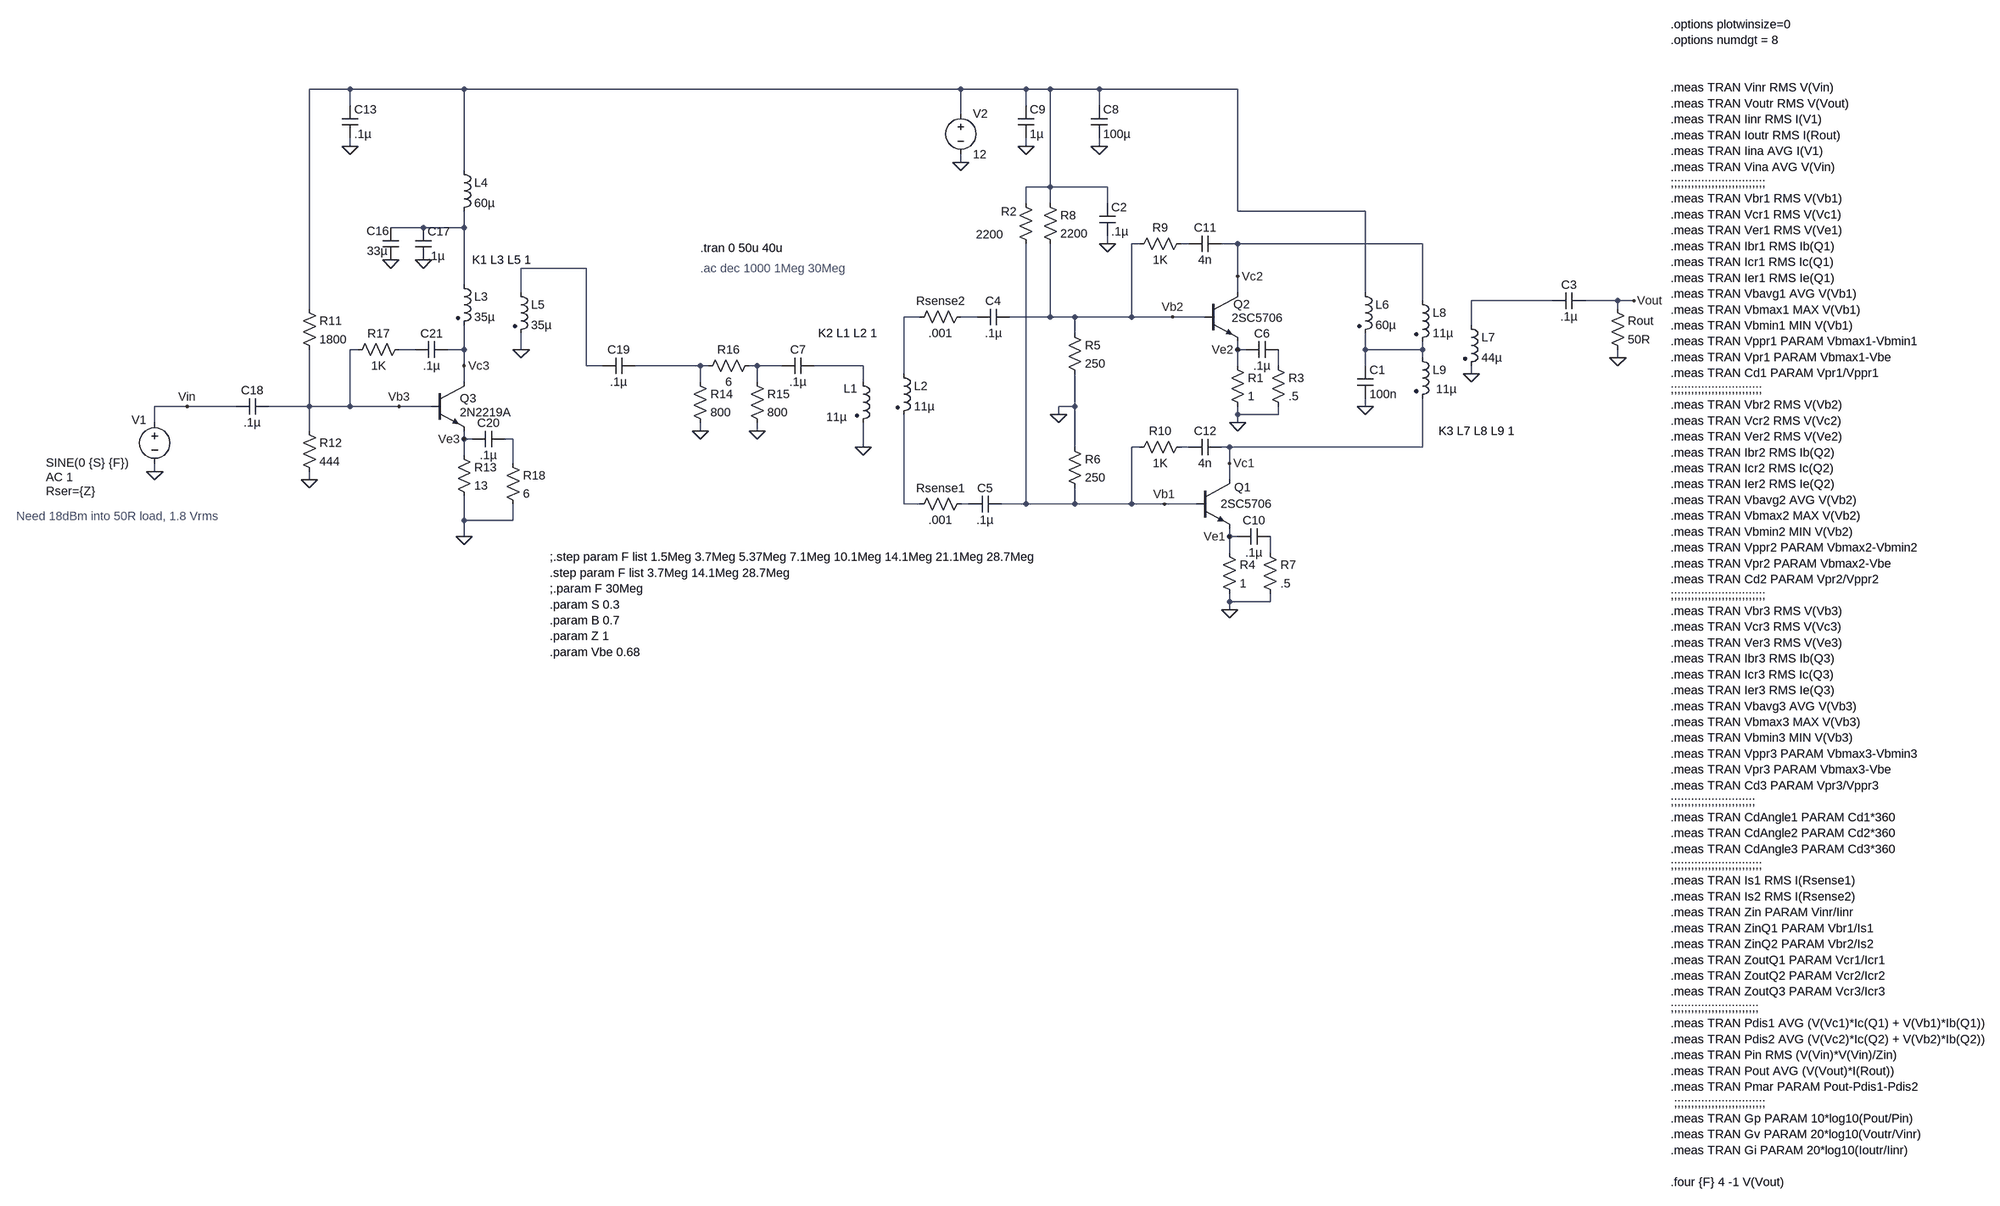
[diagram p0: schematic 2N2219+SC5706 Push-Pull.asc]
2N2219+SC5706 Push-Pull.asc, the LTspice schematic file:
Version 4
SHEET 1 3748 1496
WIRE -1312 -624 -1392 -624
WIRE -1088 -624 -1312 -624
WIRE -112 -624 -1088 -624
WIRE 16 -624 -112 -624
WIRE 64 -624 16 -624
WIRE 160 -624 64 -624
WIRE 432 -624 160 -624
WIRE -1312 -592 -1312 -624
WIRE 16 -592 16 -624
WIRE 160 -592 160 -624
WIRE -112 -576 -112 -624
WIRE -1312 -512 -1312 -528
WIRE 16 -512 16 -528
WIRE 160 -512 160 -528
WIRE -112 -480 -112 -496
WIRE -1088 -464 -1088 -624
WIRE 64 -432 64 -624
WIRE 64 -432 16 -432
WIRE 176 -432 64 -432
WIRE 16 -400 16 -432
WIRE 64 -400 64 -432
WIRE 176 -400 176 -432
WIRE 432 -384 432 -624
WIRE 688 -384 432 -384
WIRE -1168 -352 -1232 -352
WIRE -1088 -352 -1088 -384
WIRE -1088 -352 -1168 -352
WIRE 176 -320 176 -336
WIRE 240 -320 224 -320
WIRE 336 -320 320 -320
WIRE 432 -320 400 -320
WIRE 800 -320 432 -320
WIRE -848 -272 -976 -272
WIRE 432 -256 432 -320
WIRE -1088 -240 -1088 -352
WIRE -976 -224 -976 -272
WIRE 432 -224 432 -256
WIRE 688 -224 688 -384
WIRE 800 -208 800 -320
WIRE 1056 -208 896 -208
WIRE 1184 -208 1120 -208
WIRE 1216 -208 1184 -208
WIRE -1392 -192 -1392 -624
WIRE 1184 -192 1184 -208
WIRE -192 -176 -224 -176
WIRE -80 -176 -112 -176
WIRE 64 -176 64 -320
WIRE 64 -176 -16 -176
WIRE 112 -176 64 -176
WIRE 224 -176 224 -320
WIRE 224 -176 112 -176
WIRE 304 -176 224 -176
WIRE 368 -176 304 -176
WIRE 896 -160 896 -208
WIRE 112 -144 112 -176
WIRE -1296 -112 -1312 -112
WIRE -1184 -112 -1216 -112
WIRE -1088 -112 -1088 -160
WIRE -1088 -112 -1120 -112
WIRE -976 -112 -976 -144
WIRE 432 -112 432 -128
WIRE 448 -112 432 -112
WIRE 688 -112 688 -144
WIRE 800 -112 800 -128
WIRE 800 -112 688 -112
WIRE 800 -96 800 -112
WIRE 1184 -96 1184 -112
WIRE -1088 -80 -1088 -112
WIRE -848 -80 -848 -272
WIRE -816 -80 -848 -80
WIRE -624 -80 -752 -80
WIRE -608 -80 -624 -80
WIRE -512 -80 -528 -80
WIRE -464 -80 -512 -80
WIRE -304 -80 -400 -80
WIRE 432 -80 432 -112
WIRE 512 -80 512 -112
WIRE 688 -80 688 -112
WIRE -224 -64 -224 -176
WIRE 896 -64 896 -80
WIRE -1088 -48 -1088 -80
WIRE -624 -48 -624 -80
WIRE -512 -48 -512 -80
WIRE -304 -48 -304 -80
WIRE -1632 0 -1696 0
WIRE -1536 0 -1632 0
WIRE -1392 0 -1392 -112
WIRE -1392 0 -1472 0
WIRE -1312 0 -1312 -112
WIRE -1312 0 -1392 0
WIRE -1216 0 -1312 0
WIRE -1152 0 -1216 0
WIRE 112 0 112 -64
WIRE 112 0 80 0
WIRE 688 0 688 -16
WIRE 80 16 80 0
WIRE 432 16 432 0
WIRE 512 16 512 0
WIRE 512 16 432 16
WIRE -1696 32 -1696 0
WIRE 432 32 432 16
WIRE -1392 48 -1392 0
WIRE -624 48 -624 32
WIRE -512 48 -512 32
WIRE -1088 64 -1088 48
WIRE -1072 64 -1088 64
WIRE -992 64 -1008 64
WIRE -304 80 -304 32
WIRE 112 80 112 0
WIRE 240 80 224 80
WIRE 336 80 320 80
WIRE 416 80 400 80
WIRE 800 80 800 -16
WIRE 800 80 416 80
WIRE -1088 96 -1088 64
WIRE -992 112 -992 64
WIRE 416 112 416 80
WIRE -1696 128 -1696 112
WIRE -1392 144 -1392 128
WIRE 416 144 416 112
WIRE -224 192 -224 16
WIRE -192 192 -224 192
WIRE -96 192 -112 192
WIRE 16 192 16 -320
WIRE 16 192 -32 192
WIRE 112 192 112 160
WIRE 112 192 16 192
WIRE 224 192 224 80
WIRE 224 192 112 192
WIRE 288 192 224 192
WIRE 352 192 288 192
WIRE -1088 224 -1088 176
WIRE -992 224 -992 192
WIRE -992 224 -1088 224
WIRE -1088 256 -1088 224
WIRE 416 256 416 240
WIRE 432 256 416 256
WIRE 416 288 416 256
WIRE 496 288 496 256
WIRE 416 384 416 368
WIRE 496 384 496 368
WIRE 496 384 416 384
WIRE 416 400 416 384
FLAG -112 -480 0
FLAG -1696 128 0
FLAG 416 400 0
FLAG 1216 -208 Vout
FLAG 1184 -96 0
FLAG 288 192 Vb1
FLAG 416 256 Ve1
FLAG -1632 0 Vin
FLAG 416 112 Vc1
FLAG 432 32 0
FLAG 304 -176 Vb2
FLAG 432 -112 Ve2
FLAG 432 -256 Vc2
FLAG -304 80 0
FLAG 80 16 0
FLAG 688 0 0
FLAG 176 -320 0
FLAG 16 -512 0
FLAG 896 -64 0
FLAG 160 -512 0
FLAG -1312 -512 0
FLAG -1392 144 0
FLAG -1088 256 0
FLAG -1232 -288 0
FLAG -1168 -288 0
FLAG -1216 0 Vb3
FLAG -1088 64 Ve3
FLAG -1088 -80 Vc3
FLAG -624 48 0
FLAG -512 48 0
FLAG -976 -112 0
SYMBOL npn 352 144 R0
WINDOW 0 73 15 Left 2
WINDOW 3 47 48 Left 2
SYMATTR InstName Q1
SYMATTR Value 2SC5706
SYMBOL voltage -1696 16 R0
WINDOW 0 -45 11 Left 2
WINDOW 3 -214 95 Left 2
WINDOW 123 -214 123 Left 2
WINDOW 39 -214 151 Left 2
SYMATTR InstName V1
SYMATTR Value SINE(0 {S} {F})
SYMATTR Value2 AC 1
SYMATTR SpiceLine Rser={Z}
SYMBOL voltage -112 -592 R0
WINDOW 123 0 0 Left 0
WINDOW 39 0 0 Left 0
SYMATTR InstName V2
SYMATTR Value 12
SYMBOL res 400 272 R0
SYMATTR InstName R4
SYMATTR Value 1
SYMBOL cap 1120 -224 R90
WINDOW 0 0 32 VBottom 2
WINDOW 3 32 32 VTop 2
SYMATTR InstName C3
SYMATTR Value .1µ
SYMBOL res 1168 -208 R0
SYMATTR InstName Rout
SYMATTR Value 50R
SYMBOL cap -400 -96 R90
WINDOW 0 0 32 VBottom 2
WINDOW 3 32 32 VTop 2
SYMATTR InstName C7
SYMATTR Value .1µ
SYMBOL npn 368 -224 R0
WINDOW 0 56 23 Left 2
WINDOW 3 52 50 Left 2
SYMATTR InstName Q2
SYMATTR Value 2SC5706
SYMBOL res 416 -96 R0
SYMATTR InstName R1
SYMATTR Value 1
SYMBOL ind2 -320 -64 R0
WINDOW 0 -22 29 Left 2
WINDOW 3 -56 85 Left 2
SYMATTR InstName L1
SYMATTR Value 11µ
SYMATTR Type ind
SYMBOL ind2 -240 -80 R0
SYMATTR InstName L2
SYMATTR Value 11µ
SYMATTR Type ind
SYMBOL res 48 -416 R0
SYMATTR InstName R8
SYMATTR Value 2200
SYMBOL res 96 -160 R0
SYMATTR InstName R5
SYMATTR Value 250
SYMBOL res 96 64 R0
SYMATTR InstName R6
SYMATTR Value 250
SYMBOL ind2 784 -224 R0
SYMATTR InstName L8
SYMATTR Value 11µ
SYMATTR Type ind
SYMBOL ind2 784 -112 R0
WINDOW 3 43 78 Left 2
SYMATTR Value 11µ
SYMATTR InstName L9
SYMATTR Type ind
SYMBOL ind2 880 -176 R0
SYMATTR InstName L7
SYMATTR Value 44µ
SYMATTR Type ind
SYMBOL ind2 672 -240 R0
SYMATTR InstName L6
SYMATTR Value 60µ
SYMATTR Type ind
SYMBOL cap 672 -80 R0
SYMATTR InstName C1
SYMATTR Value 100n
SYMBOL cap 160 -400 R0
SYMATTR InstName C2
SYMATTR Value .1µ
SYMBOL cap 0 -592 R0
SYMATTR InstName C9
SYMATTR Value 1µ
SYMBOL res 0 -416 R0
WINDOW 0 -33 33 Left 2
WINDOW 3 -82 78 Left 2
SYMATTR InstName R2
SYMATTR Value 2200
SYMBOL cap 144 -592 R0
SYMATTR InstName C8
SYMATTR Value 100µ
SYMBOL res -96 -192 R90
WINDOW 0 0 56 VBottom 2
WINDOW 3 32 56 VTop 2
SYMATTR InstName Rsense2
SYMATTR Value .001
SYMBOL res -96 176 R90
WINDOW 0 0 56 VBottom 2
WINDOW 3 32 56 VTop 2
SYMATTR InstName Rsense1
SYMATTR Value .001
SYMBOL cap -16 -192 R90
WINDOW 0 0 32 VBottom 2
WINDOW 3 32 32 VTop 2
SYMATTR InstName C4
SYMATTR Value .1µ
SYMBOL cap -32 176 R90
WINDOW 0 0 32 VBottom 2
WINDOW 3 32 32 VTop 2
SYMATTR InstName C5
SYMATTR Value .1µ
SYMBOL cap 512 -128 R90
WINDOW 0 0 32 VBottom 2
WINDOW 3 32 32 VTop 2
SYMATTR InstName C6
SYMATTR Value .1µ
SYMBOL cap 496 240 R90
WINDOW 0 0 32 VBottom 2
WINDOW 3 32 32 VTop 2
SYMATTR InstName C10
SYMATTR Value .1µ
SYMBOL res 496 -96 R0
SYMATTR InstName R3
SYMATTR Value .5
SYMBOL res 480 272 R0
SYMATTR InstName R7
SYMATTR Value .5
SYMBOL cap 400 -336 R90
WINDOW 0 0 32 VBottom 2
WINDOW 3 32 32 VTop 2
SYMATTR InstName C11
SYMATTR Value 4n
SYMBOL res 336 -336 R90
WINDOW 0 0 56 VBottom 2
WINDOW 3 32 56 VTop 2
SYMATTR InstName R9
SYMATTR Value 1K
SYMBOL cap 400 64 R90
WINDOW 0 0 32 VBottom 2
WINDOW 3 32 32 VTop 2
SYMATTR InstName C12
SYMATTR Value 4n
SYMBOL res 336 64 R90
WINDOW 0 0 56 VBottom 2
WINDOW 3 32 56 VTop 2
SYMATTR InstName R10
SYMATTR Value 1K
SYMBOL res -1408 -208 R0
SYMATTR InstName R11
SYMATTR Value 1800
SYMBOL res -1408 32 R0
SYMATTR InstName R12
SYMATTR Value 444
SYMBOL res -1104 80 R0
SYMATTR InstName R13
SYMATTR Value 13
SYMBOL cap -1328 -592 R0
SYMATTR InstName C13
SYMATTR Value .1µ
SYMBOL ind2 -1104 -256 R0
SYMATTR InstName L3
SYMATTR Value 35µ
SYMATTR Type ind
SYMBOL ind -1104 -480 R0
SYMATTR InstName L4
SYMATTR Value 60µ
SYMBOL cap -1248 -352 R0
WINDOW 0 -32 7 Left 2
WINDOW 3 -31 46 Left 2
SYMATTR InstName C16
SYMATTR Value 33µ
SYMBOL cap -1184 -352 R0
SYMATTR InstName C17
SYMATTR Value .1µ
SYMBOL cap -1472 -16 R90
WINDOW 0 0 32 VBottom 2
WINDOW 3 32 32 VTop 2
SYMATTR InstName C18
SYMATTR Value .1µ
SYMBOL res -640 -64 R0
SYMATTR InstName R14
SYMATTR Value 800
SYMBOL res -528 -64 R0
SYMATTR InstName R15
SYMATTR Value 800
SYMBOL res -512 -96 R90
WINDOW 0 0 56 VBottom 2
WINDOW 3 32 56 VTop 2
SYMATTR InstName R16
SYMATTR Value 6
SYMBOL ind2 -992 -240 R0
SYMATTR InstName L5
SYMATTR Value 35µ
SYMATTR Type ind
SYMBOL cap -752 -96 R90
WINDOW 0 0 32 VBottom 2
WINDOW 3 32 32 VTop 2
SYMATTR InstName C19
SYMATTR Value .1µ
SYMBOL npn -1152 -48 R0
WINDOW 3 56 60 Left 2
SYMATTR InstName Q3
SYMATTR Value 2N2219A
SYMBOL cap -1008 48 R90
WINDOW 0 0 32 VBottom 2
WINDOW 3 32 32 VTop 2
SYMATTR InstName C20
SYMATTR Value .1µ
SYMBOL cap -1120 -128 R90
WINDOW 0 0 32 VBottom 2
WINDOW 3 32 32 VTop 2
SYMATTR InstName C21
SYMATTR Value .1µ
SYMBOL res -1200 -128 R90
WINDOW 0 0 56 VBottom 2
WINDOW 3 32 56 VTop 2
SYMATTR InstName R17
SYMATTR Value 1K
SYMBOL res -1008 96 R0
SYMATTR InstName R18
SYMATTR Value 6
TEXT -624 -312 Left 2 !.tran 0 50u 40u
TEXT 1288 -752 Left 2 !.options plotwinsize=0\n.options numdgt = 8\n \n \n.meas TRAN Vinr RMS V(Vin)\n.meas TRAN Voutr RMS V(Vout)\n.meas TRAN Iinr RMS I(V1)\n.meas TRAN Ioutr RMS I(Rout)\n.meas TRAN Iina AVG I(V1)\n.meas TRAN Vina AVG V(Vin)\n;;;;;;;;;;;;;;;;;;;;;;;;;;;;\n.meas TRAN Vbr1 RMS V(Vb1)\n.meas TRAN Vcr1 RMS V(Vc1)\n.meas TRAN Ver1 RMS V(Ve1)\n.meas TRAN Ibr1 RMS Ib(Q1)\n.meas TRAN Icr1 RMS Ic(Q1)\n.meas TRAN Ier1 RMS Ie(Q1)\n.meas TRAN Vbavg1 AVG V(Vb1)\n.meas TRAN Vbmax1 MAX V(Vb1)\n.meas TRAN Vbmin1 MIN V(Vb1)\n.meas TRAN Vppr1 PARAM Vbmax1-Vbmin1\n.meas TRAN Vpr1 PARAM Vbmax1-Vbe\n.meas TRAN Cd1 PARAM Vpr1/Vppr1\n;;;;;;;;;;;;;;;;;;;;;;;;;;;\n.meas TRAN Vbr2 RMS V(Vb2)\n.meas TRAN Vcr2 RMS V(Vc2)\n.meas TRAN Ver2 RMS V(Ve2)\n.meas TRAN Ibr2 RMS Ib(Q2)\n.meas TRAN Icr2 RMS Ic(Q2)\n.meas TRAN Ier2 RMS Ie(Q2)\n.meas TRAN Vbavg2 AVG V(Vb2)\n.meas TRAN Vbmax2 MAX V(Vb2)\n.meas TRAN Vbmin2 MIN V(Vb2)\n.meas TRAN Vppr2 PARAM Vbmax2-Vbmin2\n.meas TRAN Vpr2 PARAM Vbmax2-Vbe\n.meas TRAN Cd2 PARAM Vpr2/Vppr2\n;;;;;;;;;;;;;;;;;;;;;;;;;;;;\n.meas TRAN Vbr3 RMS V(Vb3)\n.meas TRAN Vcr3 RMS V(Vc3)\n.meas TRAN Ver3 RMS V(Ve3)\n.meas TRAN Ibr3 RMS Ib(Q3)\n.meas TRAN Icr3 RMS Ic(Q3)\n.meas TRAN Ier3 RMS Ie(Q3)\n.meas TRAN Vbavg3 AVG V(Vb3)\n.meas TRAN Vbmax3 MAX V(Vb3)\n.meas TRAN Vbmin3 MIN V(Vb3)\n.meas TRAN Vppr3 PARAM Vbmax3-Vbmin3\n.meas TRAN Vpr3 PARAM Vbmax3-Vbe\n.meas TRAN Cd3 PARAM Vpr3/Vppr3\n;;;;;;;;;;;;;;;;;;;;;;;;;\n.meas TRAN CdAngle1 PARAM Cd1*360\n.meas TRAN CdAngle2 PARAM Cd2*360\n.meas TRAN CdAngle3 PARAM Cd3*360\n;;;;;;;;;;;;;;;;;;;;;;;;;;;\n.meas TRAN Is1 RMS I(Rsense1)\n.meas TRAN Is2 RMS I(Rsense2)\n.meas TRAN Zin PARAM Vinr/Iinr\n.meas TRAN ZinQ1 PARAM Vbr1/Is1\n.meas TRAN ZinQ2 PARAM Vbr2/Is2 \n.meas TRAN ZoutQ1 PARAM Vcr1/Icr1\n.meas TRAN ZoutQ2 PARAM Vcr2/Icr2\n.meas TRAN ZoutQ3 PARAM Vcr3/Icr3\n;;;;;;;;;;;;;;;;;;;;;;;;;;\n.meas TRAN Pdis1 AVG (V(Vc1)*Ic(Q1) + V(Vb1)*Ib(Q1))\n.meas TRAN Pdis2 AVG (V(Vc2)*Ic(Q2) + V(Vb2)*Ib(Q2))\n.meas TRAN Pin RMS (V(Vin)*V(Vin)/Zin)\n.meas TRAN Pout AVG (V(Vout)*I(Rout))\n.meas TRAN Pmar PARAM Pout-Pdis1-Pdis2\n ;;;;;;;;;;;;;;;;;;;;;;;;;;;\n.meas TRAN Gp PARAM 10*log10(Pout/Pin)\n.meas TRAN Gv PARAM 20*log10(Voutr/Vinr)\n.meas TRAN Gi PARAM 20*log10(Ioutr/Iinr)\n \n.four {F} 4 -1 V(Vout)
TEXT -920 296 Left 2 !;.step param F list 1.5Meg 3.7Meg 5.37Meg 7.1Meg 10.1Meg 14.1Meg 21.1Meg 28.7Meg\n.step param F list 3.7Meg 14.1Meg 28.7Meg\n;.param F 30Meg\n.param S 0.3\n.param B 0.7\n.param Z 1\n.param Vbe 0.68
TEXT -624 -272 Left 2 ;.ac dec 1000 1Meg 30Meg
TEXT 832 48 Left 2 !K3 L7 L8 L9 1
TEXT -392 -144 Left 2 !K2 L1 L2 1
TEXT -1968 216 Left 2 ;Need 18dBm into 50R load, 1.8 Vrms
TEXT -1072 -288 Left 2 !K1 L3 L5 1

The netlist it stands for:
* 2N2219+SC5706 Push-Pull.asc
Q1 Vc1 Vb1 Ve1 0 2SC5706
V1 Vin 0 SINE(0 {S} {F}) AC 1 Rser={Z}
V2 N001 0 12
R4 Ve1 0 1
C3 Vout N005 .1µ
Rout Vout 0 50R
C7 N012 N011 .1µ
Q2 Vc2 Vb2 Ve2 0 2SC5706
R1 Ve2 0 1
L1 N012 0 11µ
L2 N006 N016 11µ
R8 N001 Vb2 2200
R5 Vb2 0 250
R6 0 Vb1 250
L8 Vc2 N009 11µ
L9 N009 Vc1 11µ
L7 N005 0 44µ
L6 N001 N009 60µ
C1 N009 0 100n
C2 N001 0 .1µ
C9 N001 0 1µ
R2 N001 Vb1 2200
C8 N001 0 100µ
Rsense2 N007 N006 .001
Rsense1 N017 N016 .001
C4 Vb2 N007 .1µ
C5 Vb1 N017 .1µ
C6 N013 Ve2 .1µ
C10 N018 Ve1 .1µ
R3 N013 0 .5
R7 N018 0 .5
C11 Vc2 N003 4n
R9 N003 Vb2 1K
C12 Vc1 N015 4n
R10 N015 Vb1 1K
R11 N001 Vb3 1800
R12 Vb3 0 444
R13 Ve3 0 13
C13 N001 0 .1µ
L3 N002 Vc3 35µ
L4 N001 N002 60µ
C16 N002 0 33µ
C17 N002 0 .1µ
C18 Vb3 Vin .1µ
R14 N010 0 800
R15 N011 0 800
R16 N011 N010 6
L5 N004 0 35µ
C19 N010 N004 .1µ
Q3 Vc3 Vb3 Ve3 0 2N2219A
C20 N014 Ve3 .1µ
C21 Vc3 N008 .1µ
R17 N008 Vb3 1K
R18 N014 0 6
.model NPN NPN
.model PNP PNP
.lib standard.bjt
.tran 0 50u 40u
.options plotwinsize=0
.options numdgt = 8
.meas TRAN Vinr RMS V(Vin)
.meas TRAN Voutr RMS V(Vout)
.meas TRAN Iinr RMS I(V1)
.meas TRAN Ioutr RMS I(Rout)
.meas TRAN Iina AVG I(V1)
.meas TRAN Vina AVG V(Vin)
;;;;;;;;;;;;;;;;;;;;;;;;;;;;
.meas TRAN Vbr1 RMS V(Vb1)
.meas TRAN Vcr1 RMS V(Vc1)
.meas TRAN Ver1 RMS V(Ve1)
.meas TRAN Ibr1 RMS Ib(Q1)
.meas TRAN Icr1 RMS Ic(Q1)
.meas TRAN Ier1 RMS Ie(Q1)
.meas TRAN Vbavg1 AVG V(Vb1)
.meas TRAN Vbmax1 MAX V(Vb1)
.meas TRAN Vbmin1 MIN V(Vb1)
.meas TRAN Vppr1 PARAM Vbmax1-Vbmin1
.meas TRAN Vpr1 PARAM Vbmax1-Vbe
.meas TRAN Cd1 PARAM Vpr1/Vppr1
;;;;;;;;;;;;;;;;;;;;;;;;;;;
.meas TRAN Vbr2 RMS V(Vb2)
.meas TRAN Vcr2 RMS V(Vc2)
.meas TRAN Ver2 RMS V(Ve2)
.meas TRAN Ibr2 RMS Ib(Q2)
.meas TRAN Icr2 RMS Ic(Q2)
.meas TRAN Ier2 RMS Ie(Q2)
.meas TRAN Vbavg2 AVG V(Vb2)
.meas TRAN Vbmax2 MAX V(Vb2)
.meas TRAN Vbmin2 MIN V(Vb2)
.meas TRAN Vppr2 PARAM Vbmax2-Vbmin2
.meas TRAN Vpr2 PARAM Vbmax2-Vbe
.meas TRAN Cd2 PARAM Vpr2/Vppr2
;;;;;;;;;;;;;;;;;;;;;;;;;;;;
.meas TRAN Vbr3 RMS V(Vb3)
.meas TRAN Vcr3 RMS V(Vc3)
.meas TRAN Ver3 RMS V(Ve3)
.meas TRAN Ibr3 RMS Ib(Q3)
.meas TRAN Icr3 RMS Ic(Q3)
.meas TRAN Ier3 RMS Ie(Q3)
.meas TRAN Vbavg3 AVG V(Vb3)
.meas TRAN Vbmax3 MAX V(Vb3)
.meas TRAN Vbmin3 MIN V(Vb3)
.meas TRAN Vppr3 PARAM Vbmax3-Vbmin3
.meas TRAN Vpr3 PARAM Vbmax3-Vbe
.meas TRAN Cd3 PARAM Vpr3/Vppr3
;;;;;;;;;;;;;;;;;;;;;;;;;
.meas TRAN CdAngle1 PARAM Cd1*360
.meas TRAN CdAngle2 PARAM Cd2*360
.meas TRAN CdAngle3 PARAM Cd3*360
;;;;;;;;;;;;;;;;;;;;;;;;;;;
.meas TRAN Is1 RMS I(Rsense1)
.meas TRAN Is2 RMS I(Rsense2)
.meas TRAN Zin PARAM Vinr/Iinr
.meas TRAN ZinQ1 PARAM Vbr1/Is1
.meas TRAN ZinQ2 PARAM Vbr2/Is2
.meas TRAN ZoutQ1 PARAM Vcr1/Icr1
.meas TRAN ZoutQ2 PARAM Vcr2/Icr2
.meas TRAN ZoutQ3 PARAM Vcr3/Icr3
;;;;;;;;;;;;;;;;;;;;;;;;;;
.meas TRAN Pdis1 AVG (V(Vc1)*Ic(Q1) + V(Vb1)*Ib(Q1))
.meas TRAN Pdis2 AVG (V(Vc2)*Ic(Q2) + V(Vb2)*Ib(Q2))
.meas TRAN Pin RMS (V(Vin)*V(Vin)/Zin)
.meas TRAN Pout AVG (V(Vout)*I(Rout))
.meas TRAN Pmar PARAM Pout-Pdis1-Pdis2
 ;;;;;;;;;;;;;;;;;;;;;;;;;;;
.meas TRAN Gp PARAM 10*log10(Pout/Pin)
.meas TRAN Gv PARAM 20*log10(Voutr/Vinr)
.meas TRAN Gi PARAM 20*log10(Ioutr/Iinr)
.four {F} 4 -1 V(Vout)
;.step param F list 1.5Meg 3.7Meg 5.37Meg 7.1Meg 10.1Meg 14.1Meg 21.1Meg 28.7Meg
.step param F list 3.7Meg 14.1Meg 28.7Meg
;.param F 30Meg
.param S 0.3
.param B 0.7
.param Z 1
.param Vbe 0.68
* .ac dec 1000 1Meg 30Meg
K3 L7 L8 L9 1
K2 L1 L2 1
* Need 18dBm into 50R load, 1.8 Vrms
K1 L3 L5 1
.backanno
.end